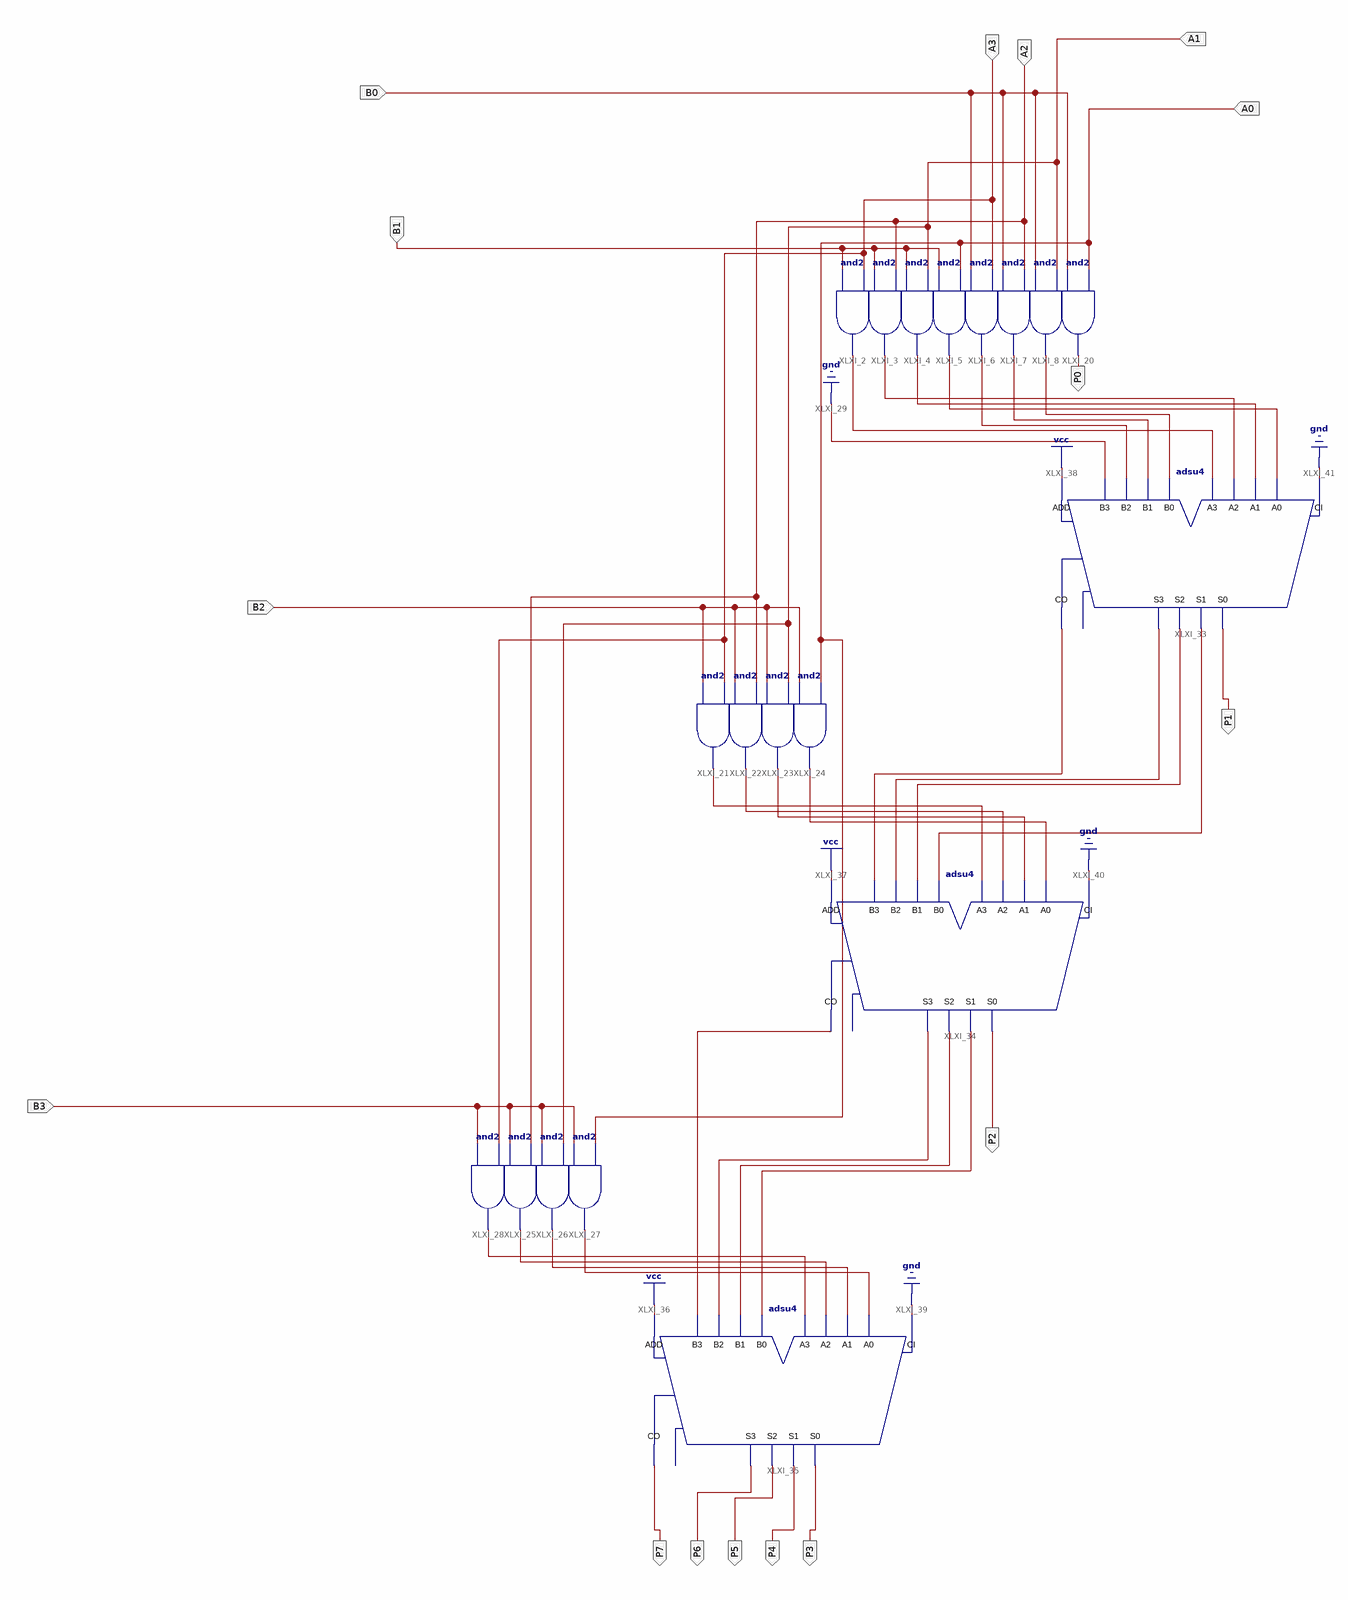
[diagram p0: schematic sheet 1]
// Xilinx ISE schematic multiply4.sch (spartan6) as structural Verilog: 19 symbols, 16 ports
module multiply4 (
  input  A0,
  input  A1,
  input  A2,
  input  A3,
  input  B0,
  input  B1,
  input  B2,
  input  B3,
  output P0,
  output P3,
  output P4,
  output P5,
  output P6,
  output P7,
  output P1,
  output P2
);

  wire XLXN_28, XLXN_29, XLXN_30, XLXN_31, XLXN_66, XLXN_67, XLXN_68, XLXN_70, XLXN_71, XLXN_72, XLXN_73,
       XLXN_79, XLXN_80, XLXN_81, XLXN_82, XLXN_85, XLXN_86, XLXN_87, XLXN_88, XLXN_89, XLXN_90, XLXN_91,
       XLXN_92;

  and XLXI_2 (XLXN_73, B1, A3);
  and XLXI_3 (XLXN_72, B1, A2);
  and XLXI_4 (XLXN_71, B1, A1);
  and XLXI_5 (XLXN_70, B1, A0);
  and XLXI_6 (XLXN_68, B0, A3);
  and XLXI_7 (XLXN_67, B0, A2);
  and XLXI_8 (XLXN_66, B0, A1);
  and XLXI_20 (P0, B0, A0);
  and XLXI_25 (XLXN_91, B3, A2);
  and XLXI_26 (XLXN_90, B3, A1);
  and XLXI_27 (XLXN_89, B3, A0);
  and XLXI_28 (XLXN_92, B3, A3);
  and XLXI_21 (XLXN_82, B2, A3);
  and XLXI_22 (XLXN_81, B2, A2);
  and XLXI_23 (XLXN_80, B2, A1);
  and XLXI_24 (XLXN_79, B2, A0);
  adsu4 XLXI_33 (
    .A0(XLXN_70), .A1(XLXN_71), .A2(XLXN_72), .A3(XLXN_73), .ADD(1'b1), .B0(XLXN_66), .B1(XLXN_67),
    .B2(XLXN_68), .B3(1'b0), .CI(1'b0), .CO(XLXN_28), .S0(P1), .S1(XLXN_31), .S2(XLXN_30), .S3(XLXN_29));  // open: OFL
  adsu4 XLXI_34 (
    .A0(XLXN_79), .A1(XLXN_80), .A2(XLXN_81), .A3(XLXN_82), .ADD(1'b1), .B0(XLXN_31), .B1(XLXN_30),
    .B2(XLXN_29), .B3(XLXN_28), .CI(1'b0), .CO(XLXN_88), .S0(P2), .S1(XLXN_85), .S2(XLXN_86), .S3(XLXN_87));  // open: OFL
  adsu4 XLXI_35 (
    .A0(XLXN_89), .A1(XLXN_90), .A2(XLXN_91), .A3(XLXN_92), .ADD(1'b1), .B0(XLXN_85), .B1(XLXN_86),
    .B2(XLXN_87), .B3(XLXN_88), .CI(1'b0), .CO(P7), .S0(P3), .S1(P4), .S2(P5), .S3(P6));  // open: OFL
endmodule
